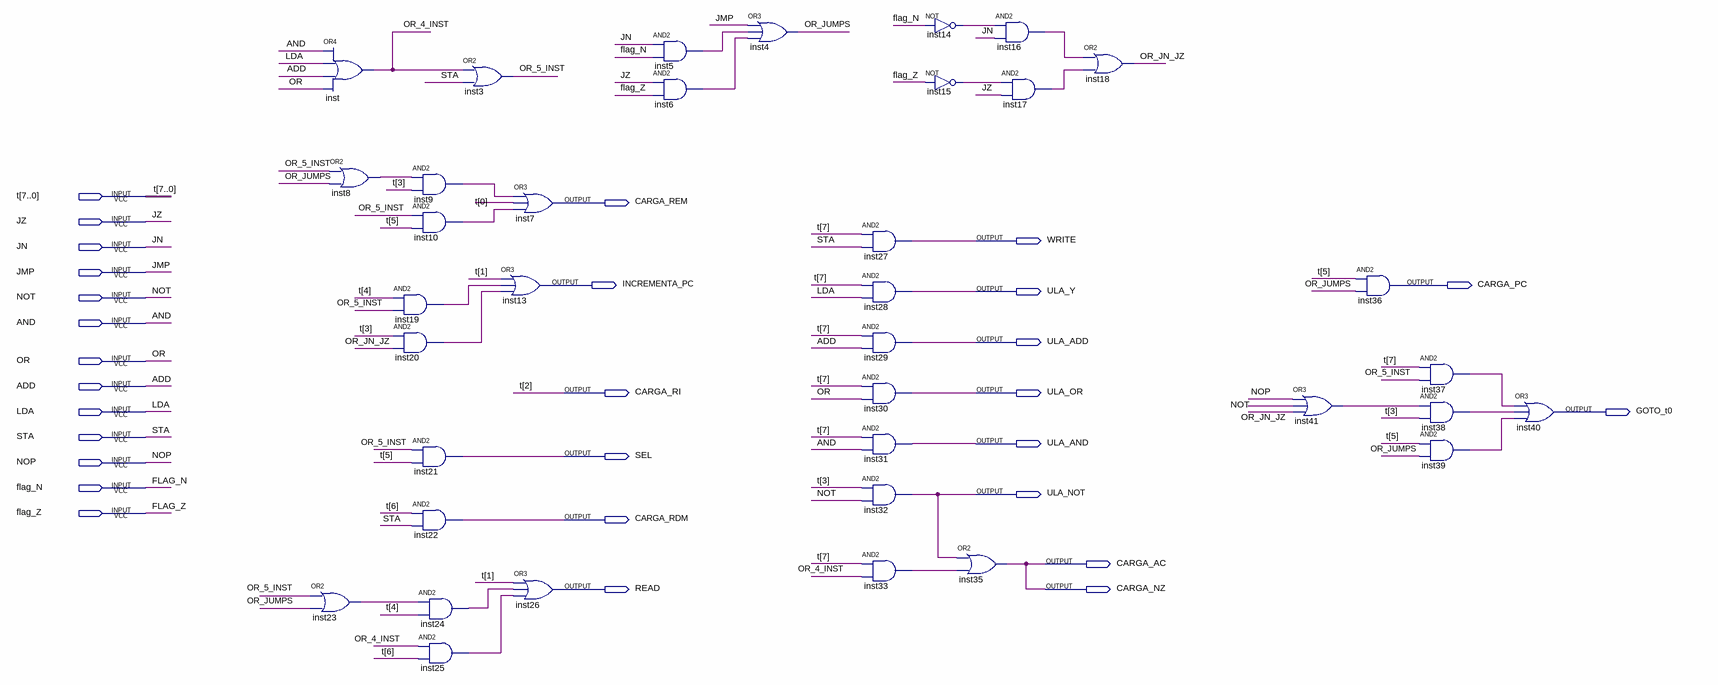
[diagram p0: schematic sheet]
// Quartus schematic UNID_CONT.bdf as structural Verilog: 37 symbols, 29 pins
module UNID_CONT (
  input  [7:0] t,
  input  JZ,
  input  JN,
  input  JMP,
  input  NOT,
  input  AND,
  input  OR,
  input  ADD,
  input  LDA,
  input  STA,
  input  NOP,
  input  flag_N,
  input  flag_Z,
  output CARGA_REM,
  output WRITE,
  output INCREMENTA_PC,
  output CARGA_PC,
  output ULA_Y,
  output ULA_ADD,
  output CARGA_RI,
  output ULA_OR,
  output GOTO_t0,
  output ULA_AND,
  output SEL,
  output ULA_NOT,
  output CARGA_RDM,
  output CARGA_AC,
  output READ,
  output CARGA_NZ
);

  wire inst5_out, inst6_out, inst8_out, inst9_out, inst10_out, inst14_out, inst15_out, inst16_out,
       inst17_out, inst19_out, inst20_out, inst23_out, inst24_out, inst25_out, inst33_out, inst37_out,
       inst38_out, inst39_out, inst41_out, OR_4_INST, OR_5_INST, OR_JN_JZ, OR_JUMPS;

  or inst (OR_4_INST, AND, LDA, ADD, OR);
  or inst23 (inst23_out, OR_5_INST, OR_JUMPS);
  or inst8 (inst8_out, OR_5_INST, OR_JUMPS);
  and inst9 (inst9_out, inst8_out, t[3]);
  and inst10 (inst10_out, OR_5_INST, t[5]);
  and inst19 (inst19_out, t[4], OR_5_INST);
  and inst20 (inst20_out, t[3], OR_JN_JZ);
  and inst21 (SEL, OR_5_INST, t[5]);
  and inst22 (CARGA_RDM, t[6], STA);
  and inst24 (inst24_out, inst23_out, t[4]);
  and inst25 (inst25_out, OR_4_INST, t[6]);
  or inst3 (OR_5_INST, OR_4_INST, STA);
  or inst7 (CARGA_REM, inst9_out, t[0], inst10_out);
  or inst13 (INCREMENTA_PC, t[1], inst19_out, inst20_out);
  or inst26 (READ, t[1], inst24_out, inst25_out);
  and inst5 (inst5_out, JN, flag_N);
  and inst6 (inst6_out, JZ, flag_Z);
  or inst4 (OR_JUMPS, JMP, inst5_out, inst6_out);
  and inst27 (WRITE, t[7], STA);
  and inst28 (ULA_Y, t[7], LDA);
  and inst29 (ULA_ADD, t[7], ADD);
  and inst30 (ULA_OR, t[7], OR);
  and inst31 (ULA_AND, t[7], AND);
  and inst32 (ULA_NOT, t[3], NOT);
  and inst33 (inst33_out, t[7], OR_4_INST);
  not inst14 (inst14_out, flag_N);
  not inst15 (inst15_out, flag_Z);
  or inst35 (CARGA_AC, ULA_NOT, inst33_out);
  and inst16 (inst16_out, inst14_out, JN);
  and inst17 (inst17_out, inst15_out, JZ);
  or inst18 (OR_JN_JZ, inst16_out, inst17_out);
  or inst41 (inst41_out, NOP, NOT, OR_JN_JZ);
  and inst36 (CARGA_PC, t[5], OR_JUMPS);
  and inst37 (inst37_out, t[7], OR_5_INST);
  and inst38 (inst38_out, inst41_out, t[3]);
  and inst39 (inst39_out, t[5], OR_JUMPS);
  or inst40 (GOTO_t0, inst37_out, inst38_out, inst39_out);

  assign CARGA_NZ = CARGA_AC;
  assign CARGA_RI = t[2];
endmodule
